# Altium schematic sheet Power.SchDoc
size A4; SheetNumber: 4; SheetTotal: 4
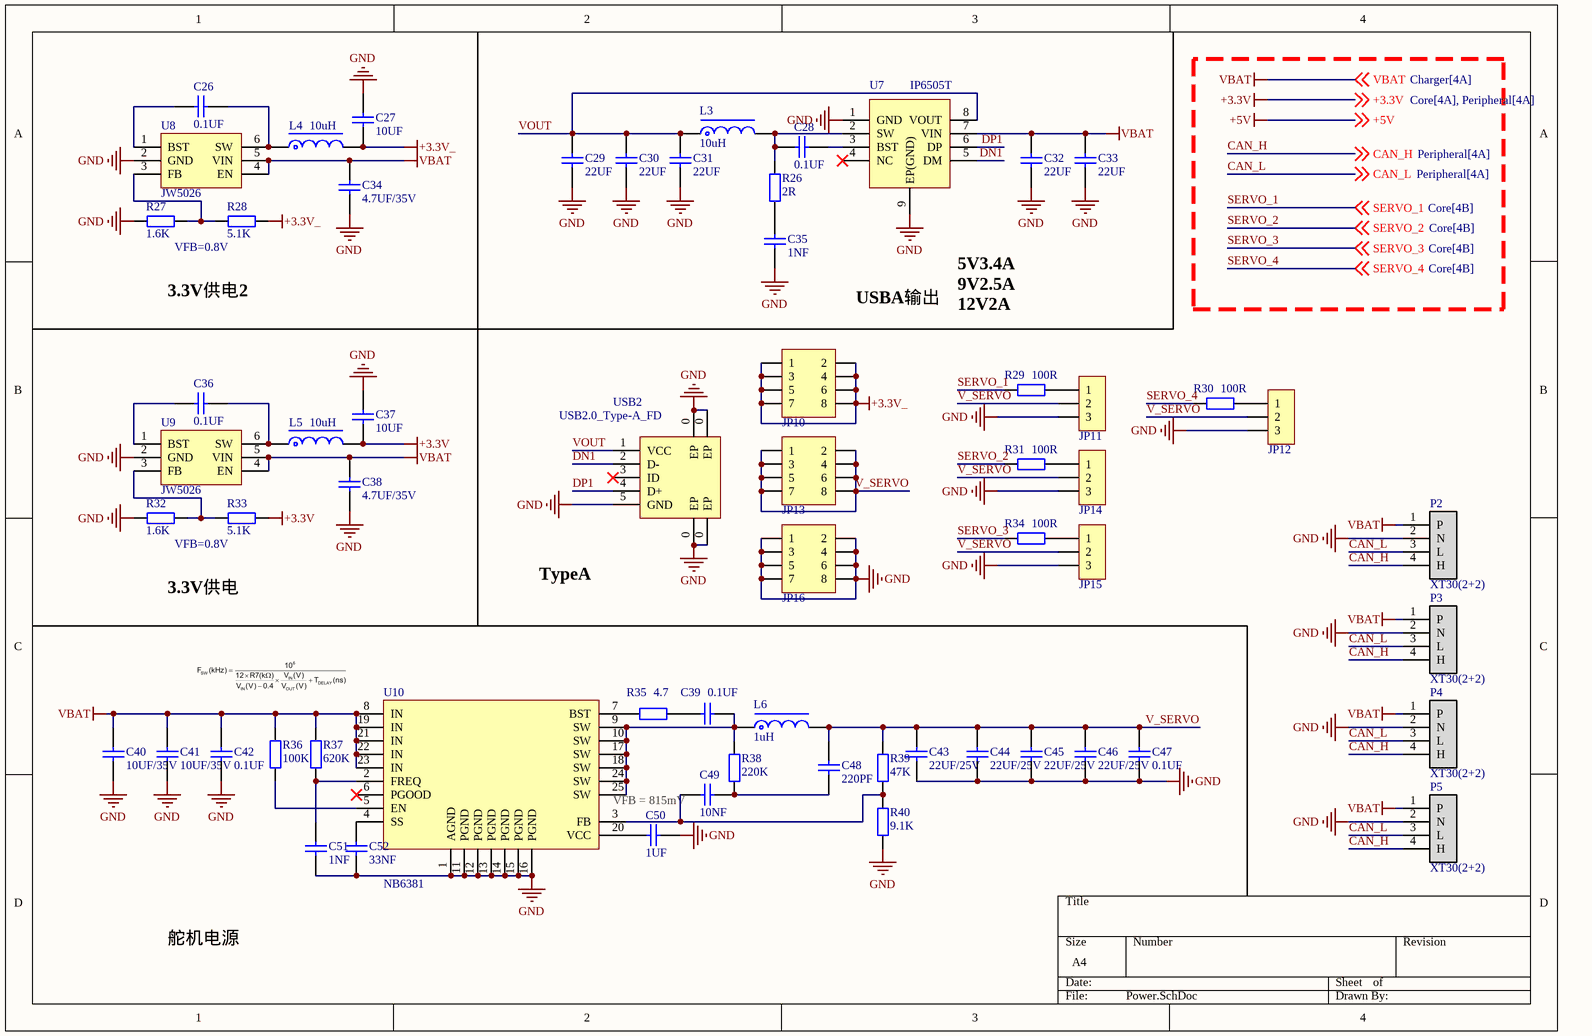
[diagram p0: Power.SchDoc]

## Parts
C26  0.1UF  [C0402_NS]
C27  10UF  [C0805_NS]
C28  0.1UF  [C0402_NS]
C29  22UF  [C0805_NS]
C30  22UF  [C0805_NS]
C31  22UF  [C0805_NS]
C32  22UF  [C0805_NS]
C33  22UF  [C0805_NS]
C34  4.7UF/35V  [C0603_NS]
C35  1NF  [C0402_NS]
C36  0.1UF  [C0402_NS]
C37  10UF  [C0805_NS]
C38  4.7UF/35V  [C0603_NS]
C39  0.1UF  [C0402_NS]
C40  10UF/35V  [C0805_NS]
C41  10UF/35V  [C0805_NS]
C42  0.1UF  [C0603_NS]
C43  22UF/25V  [C0805_NS]
C44  22UF/25V  [C0805_NS]
C45  22UF/25V  [C0805_NS]
C46  22UF/25V  [C0805_NS]
C47  0.1UF  [C0402_NS]
C48  220PF  [C0402_NS]
C49  10NF  [C0402_NS]
C50  1UF  [C0402_NS]
C51  1NF  [C0402_NS]
C52  33NF  [C0402_NS]
JP10  Header 4X2  [HDR2.54-LI-2x4P]  (value not drawn)
JP11  HDR-1X3  [HDR2.54-LI-3P]  (value not drawn)
JP12  HDR-1X3  [HDR2.54-LI-3P]  (value not drawn)
JP13  Header 4X2  [HDR2.54-LI-2x4P]  (value not drawn)
JP14  HDR-1X3  [HDR2.54-LI-3P]  (value not drawn)
JP15  HDR-1X3  [HDR2.54-LI-3P]  (value not drawn)
JP16  Header 4X2  [HDR2.54-LI-2x4P]  (value not drawn)
L3  10uH  [L-SMD-0630]
L4  10uH  [L-SMD-0420]
L5  10uH  [L-SMD-0420]
L6  1uH  [L-SMD-0630]
P2  XT30(2+2)  [XT30(2+2)PW-M]
P3  XT30(2+2)  [XT30(2+2)PW-M]
P4  XT30(2+2)  [XT30(2+2)PW-M]
P5  XT30(2+2)  [XT30(2+2)PW-M]
R26  2R  [R0402_NS]
R27  1.6K  [R0402_NS]
R28  5.1K  [R0402_NS]
R29  100R  [R0402_NS]
R30  100R  [R0402_NS]
R31  100R  [R0402_NS]
R32  1.6K  [R0402_NS]
R33  5.1K  [R0402_NS]
R34  100R  [R0402_NS]
R35  4.7  [R0402_NS]
R36  100K  [R0402_NS]
R37  620K  [R0402_NS]
R38  220K  [R0402_NS]
R39  47K  [R0402_NS]
R40  9.1K  [R0402_NS]
U7  IP6505T  [ESOP8_L5.0_W6.0_P1.27]
U8  JW5026  [SOT23-6_L3.0_W1.7_P0.95]
U9  JW5026  [SOT23-6_L3.0_W1.7_P0.95]
U10  NB6381  [QFN20_L3.0_W4.0-P0.50]
USB2  USB2.0_Type-A_FD  [USB2.0_Type-A_SMD_FD]

## Nets
+3.3V: C37.2 L5.2 R33.1 ; off-sheet +3.3V
+3.3V_: C27.2 JP10.1 JP10.2 JP10.3 JP10.4 JP10.5 JP10.6 JP10.7 JP10.8 L4.2 R28.1
GND: C27.1 C29.1 C30.1 C31.1 C32.1 C33.1 C34.1 C35.1 C37.1 C38.1 C40.1 C41.1 C42.2 C43.1 C44.1 C45.1 C46.1 C47.2 C50.1 C51.2 C52.2 JP11.3 JP12.3 JP14.3 JP15.3 JP16.1 JP16.2 JP16.3 JP16.4 JP16.5 JP16.6 JP16.7 JP16.8 P2.2(N) P3.2(N) P4.2(N) P5.2(N) R27.2 R32.2 R40.1 U7.1(GND) U7.9(EP(GND)) U8.2(GND) U9.2(GND) U10.1(AGND) U10.11(PGND) U10.12(PGND) U10.13(PGND) U10.14(PGND) U10.15(PGND) U10.16(PGND) USB2.0(EP) USB2.5(GND)
VBAT: C32.2 C33.2 C34.2 C38.2 C40.2 C41.2 C42.1 P2.1(P) P3.1(P) P4.1(P) P5.1(P) R36.2 R37.1 U7.7(VIN) U8.4(EN) U8.5(VIN) U9.4(EN) U9.5(VIN) U10.8(IN) U10.19(IN) U10.21(IN) U10.22(IN) U10.23(IN) ; off-sheet VBAT
CAN_H: P2.4(H) P3.4(H) P4.4(H) P5.4(H) ; off-sheet CAN_H
CAN_L: P2.3(L) P3.3(L) P4.3(L) P5.3(L) ; off-sheet CAN_L
DN1: U7.5(DM) USB2.2(D-)
DP1: U7.6(DP) USB2.4(D+)
SERVO_1: R29.1 ; off-sheet SERVO_1
SERVO_2: R31.1 ; off-sheet SERVO_2
SERVO_3: R34.1 ; off-sheet SERVO_3
SERVO_4: R30.1 ; off-sheet SERVO_4
V_SERVO: C43.2 C44.2 C45.2 C46.2 C47.1 C48.2 JP11.2 JP12.2 JP13.1 JP13.2 JP13.3 JP13.4 JP13.5 JP13.6 JP13.7 JP13.8 JP14.2 JP15.2 L6.2 R39.2
VOUT: C29.2 C30.2 C31.2 L3.1 U7.8(VOUT) USB2.1(VCC)
NetC26_1: C26.1 U8.1(BST)
NetC26_2: C26.2 L4.1 U8.6(SW)
NetC28_1: C28.1 L3.2 R26.2 U7.2(SW)
NetC28_2: C28.2 U7.3(BST)
NetC35_2: C35.2 R26.1
NetC36_1: C36.1 U9.1(BST)
NetC36_2: C36.2 L5.1 U9.6(SW)
NetC39_1: C39.1 L6.1 R38.2 U10.9(SW) U10.10(SW) U10.17(SW) U10.18(SW) U10.24(SW) U10.25(SW)
NetC39_2: C39.2 R35.2
NetC48_1: C48.1 C49.1 R38.1
NetC49_2: C49.2 R39.1 R40.2 U10.3(FB)
NetC50_2: C50.2 U10.20(VCC)
NetC51_1: C51.1 R37.2 U10.2(FREQ)
NetC52_1: C52.1 U10.4(SS)
NetJP11_1: JP11.1 R29.2
NetJP12_1: JP12.1 R30.2
NetJP14_1: JP14.1 R31.2
NetJP15_1: JP15.1 R34.2
NetR27_1: R27.1 R28.2 U8.3(FB)
NetR32_1: R32.1 R33.2 U9.3(FB)
NetR35_1: R35.1 U10.7(BST)
NetR36_1: R36.1 U10.5(EN)

Not connected (* = marked no-connect by the designer): U7 4(NC)*; U10 6(PGOOD)*; USB2 3(ID)*

## Notes on the sheet
- VFB=0.8V
- 3.3V供电2
- USBA输出
- 5V3.4A
- 9V2.5A
- 12V2A
- TypeA
- 3.3V供电
- VFB = 815mV
- 舵机电源

## Library data of the parts
C26-C52 = C: 贴片电容/MLCC电容; BOM名称: MLCC
JP10 JP13 JP16 = Header 4X2: 4*2P接插件; BOM名称: 4*2P接插件
JP11 JP12 JP14 JP15 = Header 3: 3P接插件; BOM名称: 3P接插件
L3-L6 = L-Molding Choke: 一体成型电感; BOM名称: 一体成型电感
P2-P5 = XT30(2+2): XT30(2+2)连接器
R26-R40 = R: 贴片电阻; BOM名称: 贴片电阻
U7 = IP6505T: 最大输出 24W，集成各种快充输出协议(DCP/QC2.0/QC3.0/FCP/AFC/SFCP)的 SOC IC
U8 U9 = JW5026: 40V/1A/1.1MHz同步降压转换器
U10 = NB6381: Wide Vin 4.5-28V, 8A, COT Synchronous Step-Down Converter with Internal Bias Supply; Vout: 0.8-13V; Frequency: 200kHz-1MHz; Vin: 4.5-28V
USB2 = USB2.0_Type-A_FD: USB2.0_Type-A母座,带ID; BOM名称: USB2.0_Type-A母座